# Altium schematic sheet interface.SchDoc
size A4; SheetNumber: 5; SheetTotal: 5
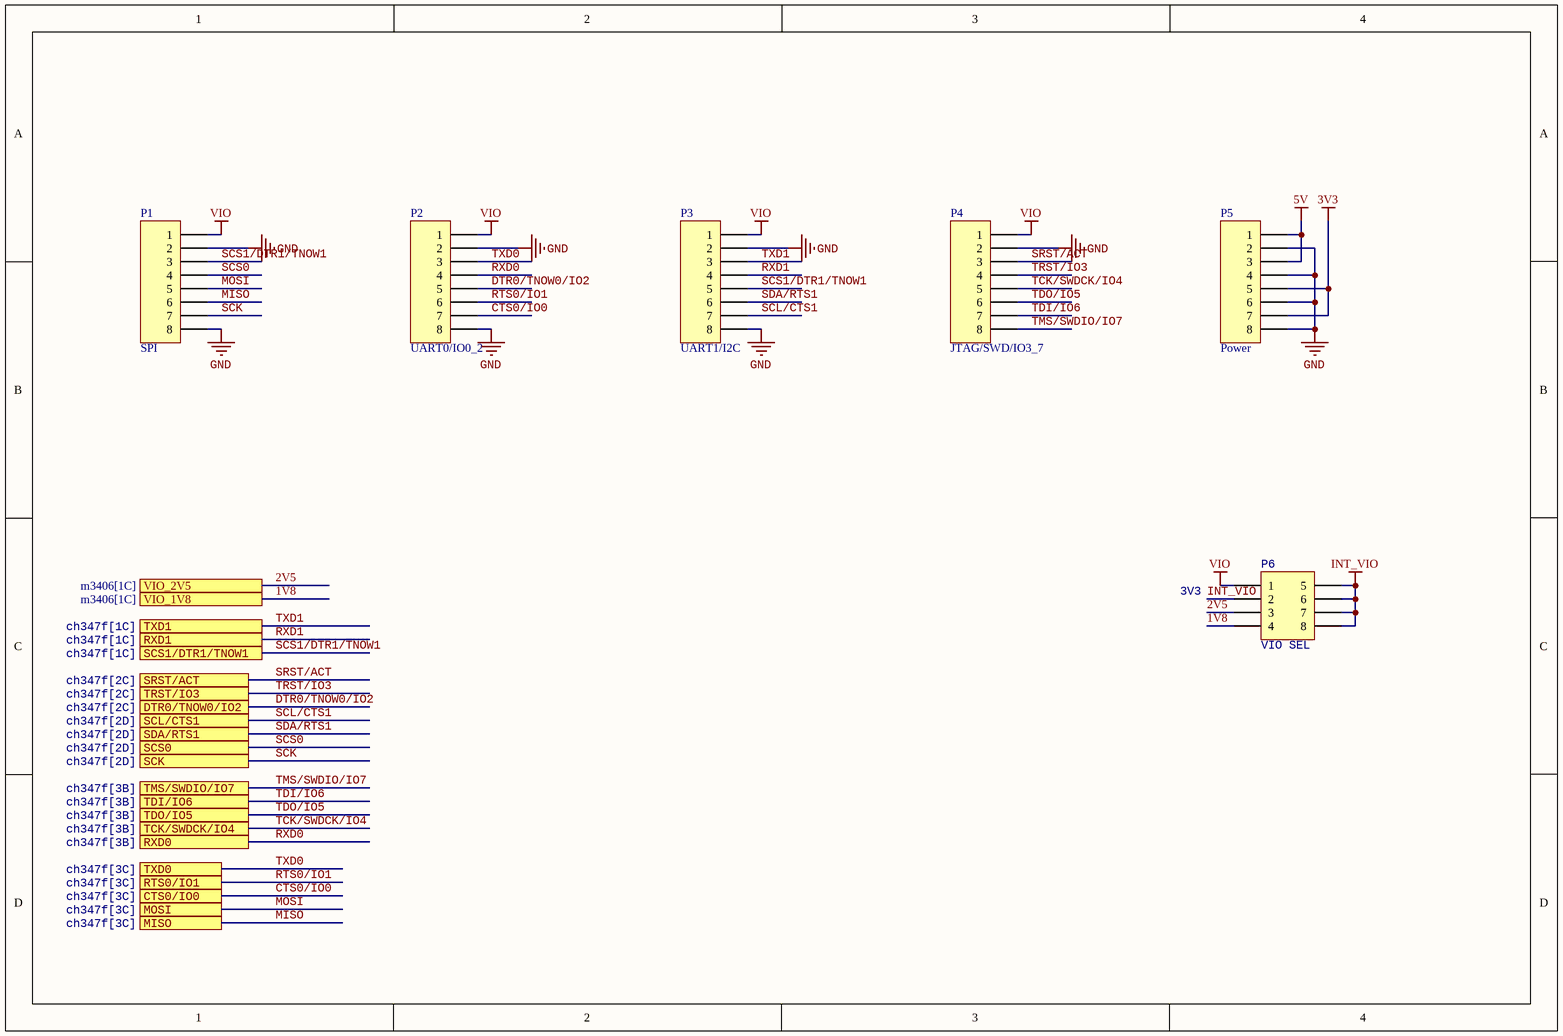
[diagram p0: interface.SchDoc]

## Parts
P1  SPI  [CONN-SMD_PH2.0-8P-LT]
P2  UART0/IO0_2  [CONN-SMD_PH2.0-8P-LT]
P3  UART1/I2C  [CONN-SMD_PH2.0-8P-LT]
P4  JTAG/SWD/IO3_7  [CONN-SMD_PH2.0-8P-LT]
P5  Power  [CONN-SMD_PH2.0-8P-LT]
P6  VIO SEL  [CONN-SMD_HX-PZ2.0-2X4P-TP]

## Ports
CTS0/IO0 (see ch347f[3C]), DTR0/TNOW0/IO2 (see ch347f[2C]), MISO (see ch347f[3C]), MOSI (see ch347f[3C]), RTS0/IO1 (see ch347f[3C]), RXD0 (see ch347f[3B]), RXD1 (see ch347f[1C]), SCK (see ch347f[2D]), SCL/CTS1 (see ch347f[2D]), SCS0 (see ch347f[2D]), SCS1/DTR1/TNOW1 (see ch347f[1C]), SDA/RTS1 (see ch347f[2D]), SRST/ACT (see ch347f[2C]), TCK/SWDCK/IO4 (see ch347f[3B]), TDI/IO6 (see ch347f[3B]), TDO/IO5 (see ch347f[3B]), TMS/SWDIO/IO7 (see ch347f[3B]), TRST/IO3 (see ch347f[2C]), TXD0 (see ch347f[3C]), TXD1 (see ch347f[1C]), VIO_1V8 (see m3406[1C]), VIO_2V5 (see m3406[1C])

## Nets
3V3: P5.5 P5.7
5V: P5.1 P5.3
GND: P1.2 P1.8 P2.2 P2.8 P3.2 P3.8 P4.2 P5.2 P5.4 P5.6 P5.8
INT_VIO: P6.2 P6.5 P6.6 P6.7 P6.8
VIO: P1.1 P2.1 P3.1 P4.1 P6.1
1V8: P6.4 ; port VIO_1V8
2V5: P6.3 ; port VIO_2V5
CTS0/IO0: P2.7 ; port CTS0/IO0
DTR0/TNOW0/IO2: P2.5 ; port DTR0/TNOW0/IO2
MISO: P1.6 ; port MISO
MOSI: P1.5 ; port MOSI
RTS0/IO1: P2.6 ; port RTS0/IO1
RXD0: P2.4 ; port RXD0
RXD1: P3.4 ; port RXD1
SCK: P1.7 ; port SCK
SCL/CTS1: P3.7 ; port SCL/CTS1
SCS0: P1.4 ; port SCS0
SCS1/DTR1/TNOW1: P1.3 P3.5 ; port SCS1/DTR1/TNOW1
SDA/RTS1: P3.6 ; port SDA/RTS1
SRST/ACT: P4.3 ; port SRST/ACT
TCK/SWDCK/IO4: P4.5 ; port TCK/SWDCK/IO4
TDI/IO6: P4.7 ; port TDI/IO6
TDO/IO5: P4.6 ; port TDO/IO5
TMS/SWDIO/IO7: P4.8 ; port TMS/SWDIO/IO7
TRST/IO3: P4.4 ; port TRST/IO3
TXD0: P2.3 ; port TXD0
TXD1: P3.3 ; port TXD1

## Notes on the sheet
- 3V3

## Library data of the parts
P1-P5 = Header 8: Header, 8-Pin; LatestRevisionDate: 17-Jul-2002; LatestRevisionNote: Re-released for DXP Platform.; Publisher: Altium Limited
P6 = Header 4X2A: Header, 4-Pin, Dual row; LatestRevisionDate: 17-Jul-2002; LatestRevisionNote: Re-released for DXP Platform.; Publisher: Altium Limited